# Altium schematic sheet EnvNode.SchDoc
size A4
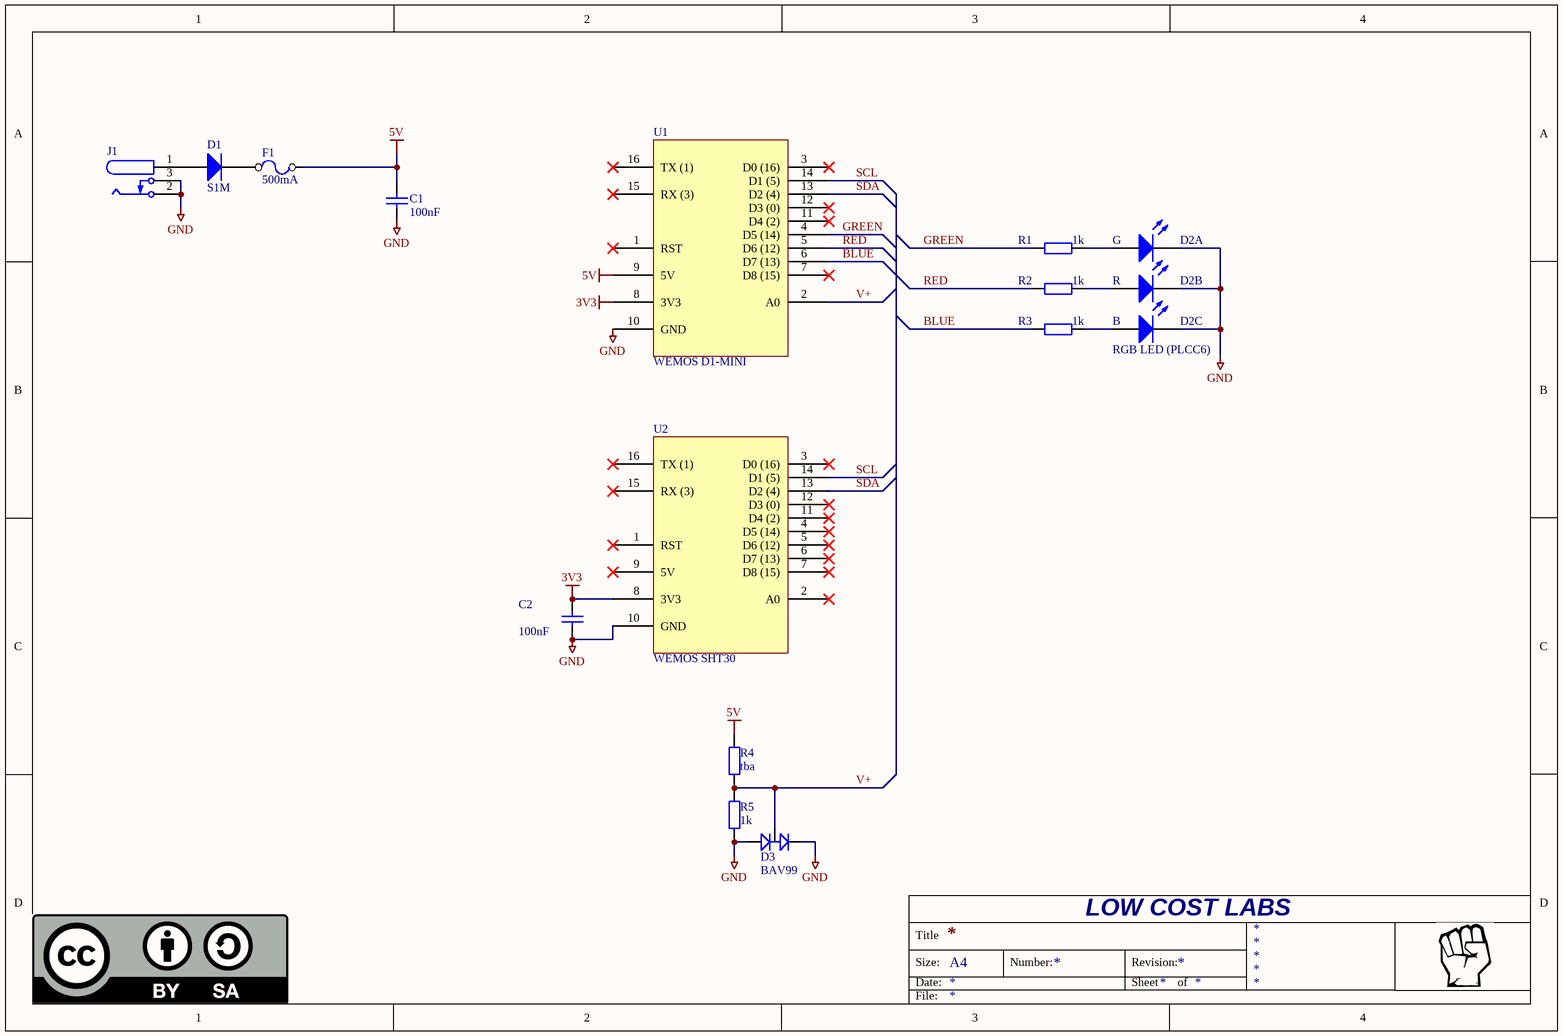
[diagram p0: EnvNode.SchDoc]

## Parts
C1  100nF  [CAPACITOR 0805]
C2  100nF  [CAPACITOR 0805]
D1  S1M  [SMA]
D2  RGB LED (PLCC6)  [PLCC-6]  (value not drawn)  (parts A,B,C of 3)
D3  BAV99  [SOT23-3L]
F1  500mA  [POLYSWITHC 1210]
J1  Switchcraft RAPC722X  [25mm DC JACK]  (value not drawn)
R1  1k  [RESISTOR 0805]
R2  1k  [RESISTOR 0805]
R3  1k  [RESISTOR 0805]
R4  tba  [RESISTOR 0805]
R5  1k  [RESISTOR 0805]
U1  WEMOS D1-MINI  [WEMOS PRO MINI]
U2  WEMOS SHT30  [WEMOS SHIELD]

## Nets
3V3: C2.2 U1.8(3V3) U2.8(3V3)
5V: C1.2 F1.2 R4.2 U1.9(5V)
GND: C1.1 C2.1 D2.4(K) D2.5(K) D2.6(K) D3.1(A1) D3.2(C2) J1.2(SLEEVE) J1.3(SHUNT) R5.1 U1.10(GND) U2.10(GND)
BLUE: R3.1 U1.6(D7_(13))
GREEN: R1.1 U1.4(D5_(14))
RED: R2.1 U1.5(D6_(12))
SCL: U1.14(D1_(5)) U2.14(D1_(5))
SDA: U1.13(D2_(4)) U2.13(D2_(4))
V+: D3.3(C1/A2) R4.1 R5.2 U1.2(A0)
NetD1_1: D1.1(A) J1.1(TIP)
NetD1_2: D1.2(K) F1.1
NetD2_1: D2.1(A) R1.2
NetD2_2: D2.2(A) R2.2
NetD2_3: D2.3(A) R3.2

Not connected (* = marked no-connect by the designer): U1 1(RST)* 3(D0_(16))* 7(D8_(15))* 11(D4_(2))* 12(D3_(0))* 15(RX_(3))* 16(TX_(1))*; U2 1(RST)* 2(A0)* 3(D0_(16))* 4(D5_(14))* 5(D6_(12))* 6(D7_(13))* 7(D8_(15))* 9(5V)* 11(D4_(2))* 12(D3_(0))* 15(RX_(3))* 16(TX_(1))*

## Notes on the sheet
- LOW COST LABS
- Title
- Size:
- Date:
- A4
- Number:
- Revision:
- Sheet
- of
- File:
- (in symbol RGB LED (PLCC6), part A) G
- (in symbol RGB LED (PLCC6), part B) R
- (in symbol RGB LED (PLCC6), part C) B

## Library data of the parts
C1 C2 = Cap: Capacitor; Value: TBA; Published: 8-Jun-2000; LatestRevisionDate: 17-Jul-2002; LatestRevisionNote: Re-released for DXP Platform.; PackageReference: RAD-0.3; Publisher: Altium Limited; PackageDescription: Radial Cap, Thru-Hole; 2 Leads; 0.3 in Pin Spacing
D1 = DIODE S1M (SMA): DIODE S1M; Value: S1M
D2 = RGB LED (PLCC6): Manufacturer: Kingbright; Manufacturer Part No.: WP132XIT; Mouser Part no.: 604-WP132XIT; Farnell Part no.: 1003393; Web link: http://au.mouser.com/Search/Refine.aspx?Keyword=604-WP132XIT
D3 = BAV99: DUAL DIODE, BAV99; Manufacturer: FAIRCHILD SEMICONDUCTOR; Mouser Part no.: 771-BAV99/T3; Farnell Part no.: 9843612; Manufacturer Part No.: BAV99; PackageReference: SOT-23; value: BAV99; Web link: http://au.mouser.com/ProductDetail/NXP-Semiconductors/BAV99-T3/?qs=sGAEpiMZZMtldOIVIVqa3WNg7zlWz8nBhXHsMX6ttIg%3d
F1 = PTC 12V POLYFUSE SMT 1210 1.10A: PTC 12V POLYFUSE SMT 1210 500mA (1210L110/12WR); Value: 500mA
J1 = DC POWER JACK (3mm): Conn; AV; Power; Jack; Mini; 2.0mmPinDia; RtAngle; Thru-hole; forS760, S765Plug; Value: Switchcraft RAPC722X
R1-R5 = Res2: Resistor; Published: 8-Jun-2000; LatestRevisionDate: 17-Jul-2002; LatestRevisionNote: Re-released for DXP Platform.; PackageReference: AXIAL-0.4; Publisher: Altium Limited; PackageDescription: Axial Device, Thru-Hole; 2 Leads; 0.4 in Pin Spacing
  R1-R3 R5: Value: 1k
  R4: Value: tba
U1 U2 = WEMOS